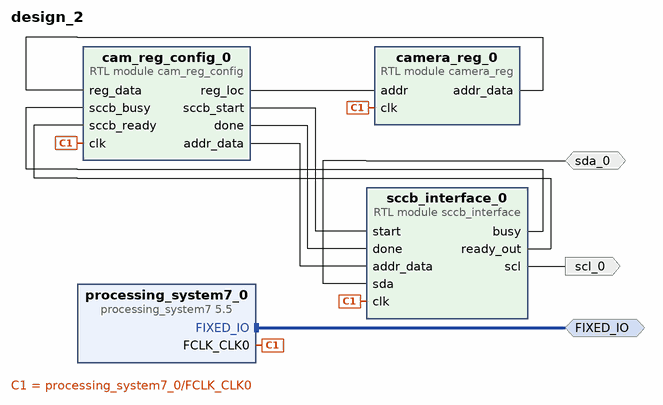
[diagram p0: block diagram of the top level]
# Vivado block design design_2, xc7z020clg400-1, Vivado 2017.4
create_bd_design design_2

create_bd_intf_port -mode Master -vlnv xilinx.com:display_processing_system7:fixedio_rtl:1.0 FIXED_IO
create_bd_port -dir O scl_0
create_bd_port -dir IO sda_0

create_bd_cell -type module -reference sccb_interface sccb_interface_0
create_bd_cell -type module -reference camera_reg camera_reg_0
create_bd_cell -type module -reference cam_reg_config cam_reg_config_0
create_bd_cell -type ip -vlnv xilinx.com:ip:processing_system7:5.5 processing_system7_0
set_property -dict [list \
  CONFIG.PCW_FPGA0_PERIPHERAL_FREQMHZ 24 \
  CONFIG.PCW_USE_M_AXI_GP0 0 \
  CONFIG.PCW_UIPARAM_DDR_ENABLE 0 \
] [get_bd_cells processing_system7_0]
# 30 more settings of processing_system7_0 are not shown: defaults, MIO pin electricals, DDR timing, and values the tool derives

# ---- connections ----

connect_bd_intf_net [get_bd_intf_ports FIXED_IO] [get_bd_intf_pins processing_system7_0/FIXED_IO]
connect_bd_net [get_bd_pins sccb_interface_0/busy] [get_bd_pins cam_reg_config_0/sccb_busy]
connect_bd_net [get_bd_pins cam_reg_config_0/sccb_start] [get_bd_pins sccb_interface_0/start]
connect_bd_net [get_bd_pins cam_reg_config_0/done] [get_bd_pins sccb_interface_0/done]
connect_bd_net [get_bd_pins cam_reg_config_0/addr_data] [get_bd_pins sccb_interface_0/addr_data]
connect_bd_net [get_bd_pins cam_reg_config_0/reg_loc] [get_bd_pins camera_reg_0/addr]
connect_bd_net [get_bd_pins camera_reg_0/addr_data] [get_bd_pins cam_reg_config_0/reg_data]
connect_bd_net [get_bd_pins sccb_interface_0/scl] [get_bd_ports scl_0]
connect_bd_net [get_bd_ports sda_0] [get_bd_pins sccb_interface_0/sda]
connect_bd_net [get_bd_pins sccb_interface_0/ready_out] [get_bd_pins cam_reg_config_0/sccb_ready]
connect_bd_net [get_bd_pins processing_system7_0/FCLK_CLK0] \
  [get_bd_pins camera_reg_0/clk] [get_bd_pins sccb_interface_0/clk] [get_bd_pins cam_reg_config_0/clk]

validate_bd_design
save_bd_design
